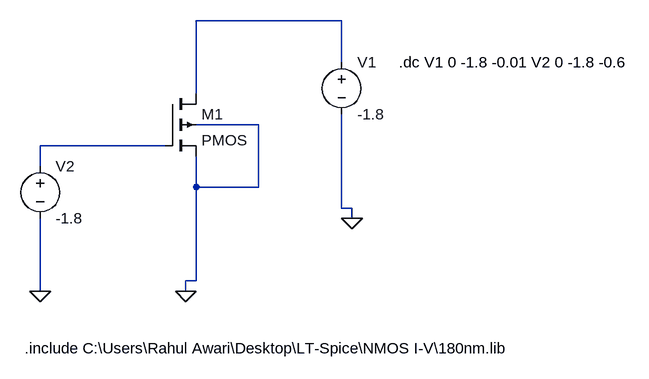
[diagram p0: schematic PMOS_short.asc]
PMOS_short.asc, the LTspice schematic file:
Version 4
SHEET 1 904 680
WIRE 432 0 208 0
WIRE 432 64 432 0
WIRE 208 112 208 0
WIRE 304 160 208 160
WIRE 160 192 -32 192
WIRE -32 224 -32 192
WIRE 208 256 208 208
WIRE 304 256 304 160
WIRE 304 256 208 256
WIRE 432 288 432 144
WIRE 448 288 432 288
WIRE 448 304 448 288
WIRE 208 400 208 256
WIRE 208 400 192 400
WIRE -32 416 -32 304
WIRE 192 416 192 400
FLAG 192 416 0
FLAG 448 304 0
FLAG -32 416 0
SYMBOL pmos4 160 112 R0
SYMATTR InstName M1
SYMATTR Value2 l=180nm w=500nm
SYMBOL voltage 432 48 R0
WINDOW 123 0 0 Left 0
WINDOW 39 0 0 Left 0
SYMATTR InstName V1
SYMATTR Value -1.8
SYMBOL voltage -32 208 R0
WINDOW 123 0 0 Left 0
WINDOW 39 0 0 Left 0
SYMATTR InstName V2
SYMATTR Value -1.8
TEXT -56 504 Left 2 !.include C:\\Users\\Rahul Awari\\Desktop\\LT-Spice\\NMOS I-V\\180nm.lib
TEXT 520 64 Left 2 !.dc V1 0 -1.8 -0.01 V2 0 -1.8 -0.6

The netlist it stands for:
* PMOS_short.asc
M1 N001 N002 0 0 PMOS l=180nm w=500nm
V1 N001 0 -1.8
V2 N002 0 -1.8
.model NMOS NMOS
.model PMOS PMOS
.lib standard.mos
.include C:\Users\Rahul Awari\Desktop\LT-Spice\NMOS I-V\180nm.lib
.dc V1 0 -1.8 -0.01 V2 0 -1.8 -0.6
.backanno
.end